# Altium schematic sheet measurement_rev4.SchDoc
size A2
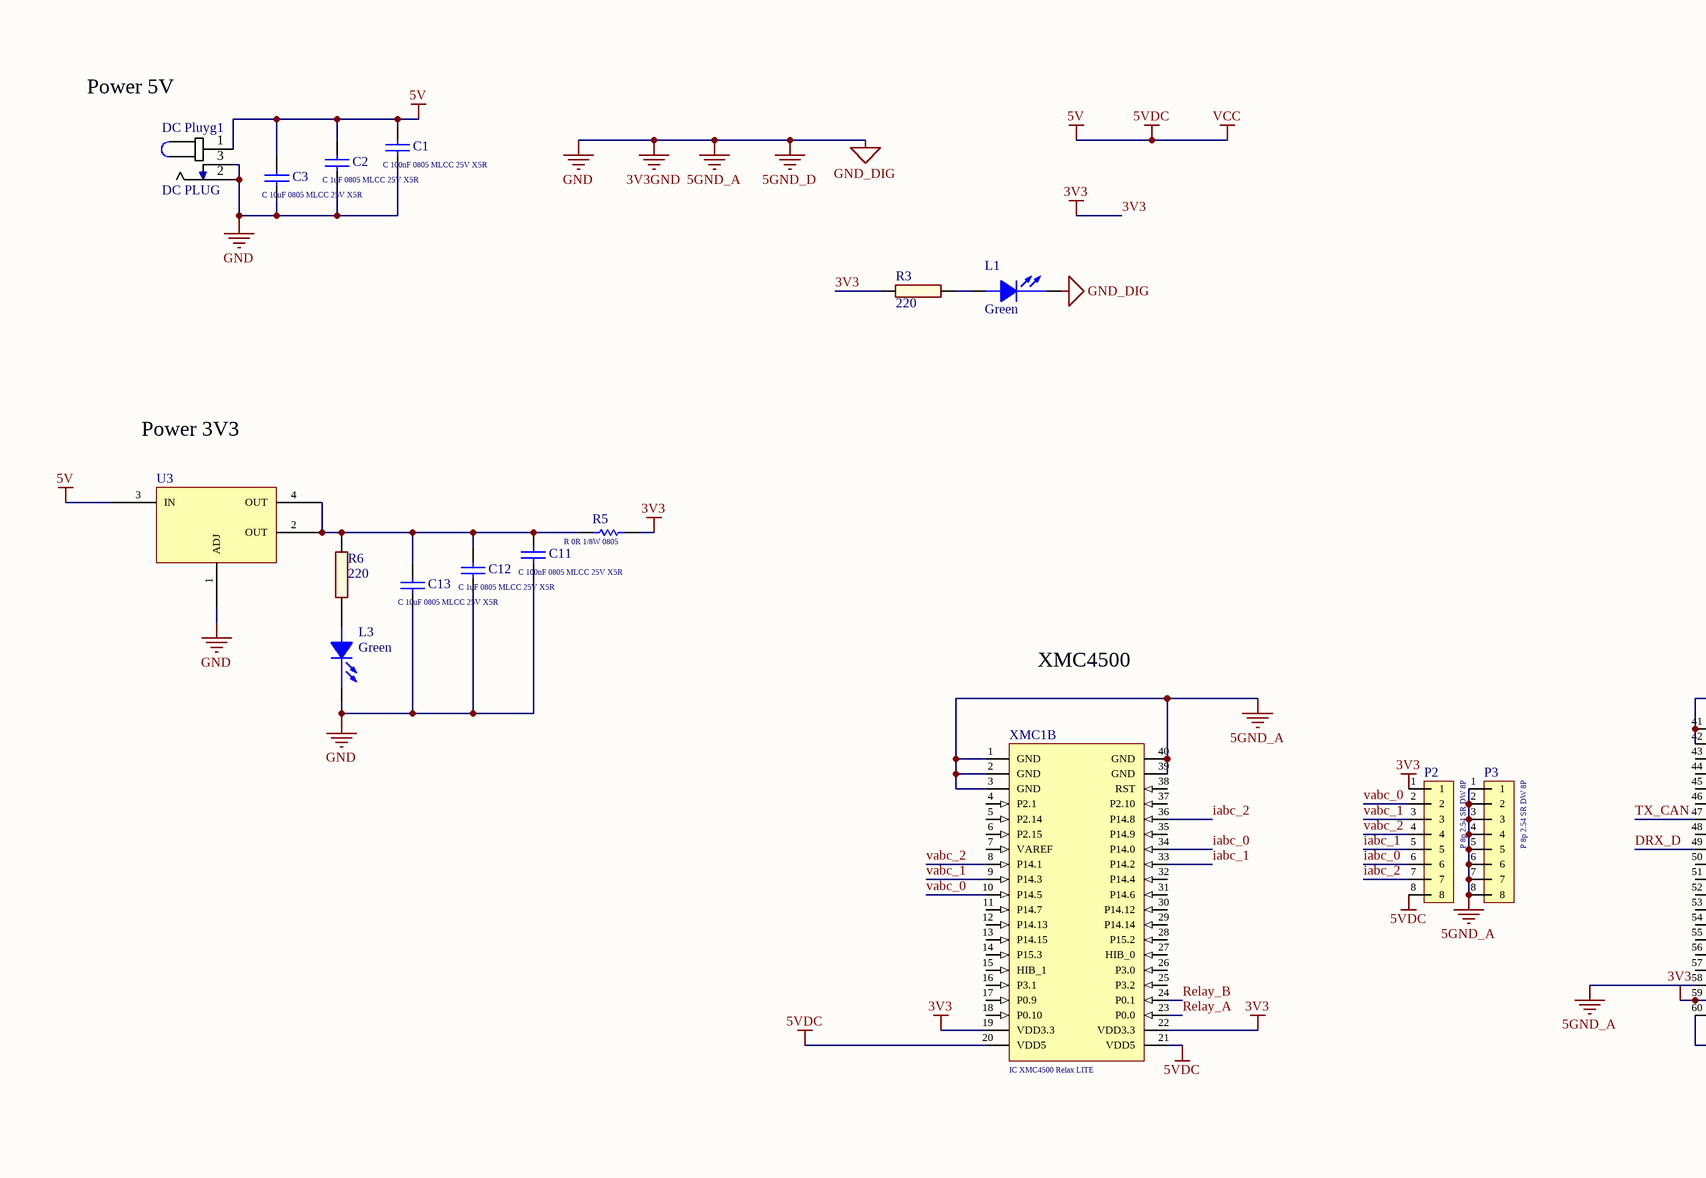
[diagram p0: measurement_rev4.SchDoc, top left]
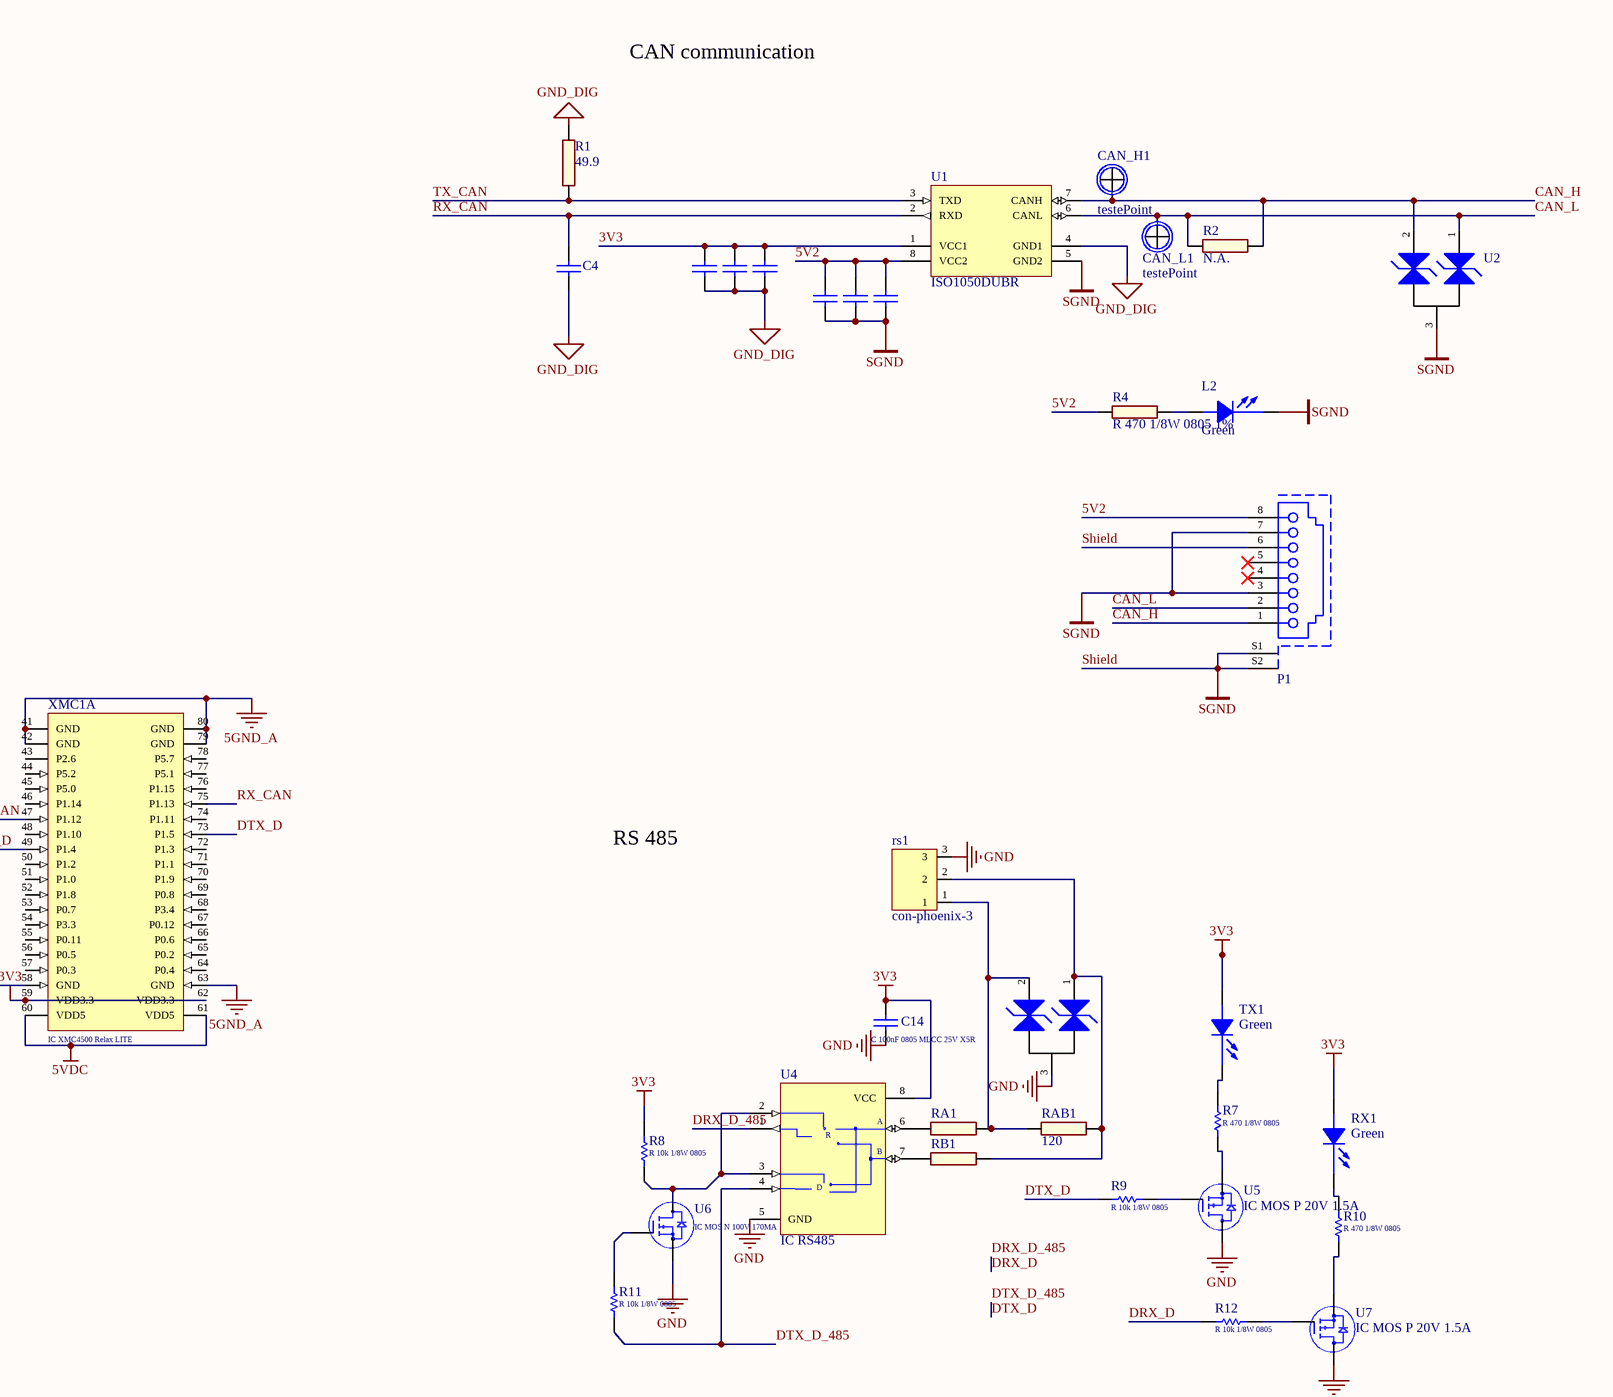
[diagram p1: measurement_rev4.SchDoc, top right]
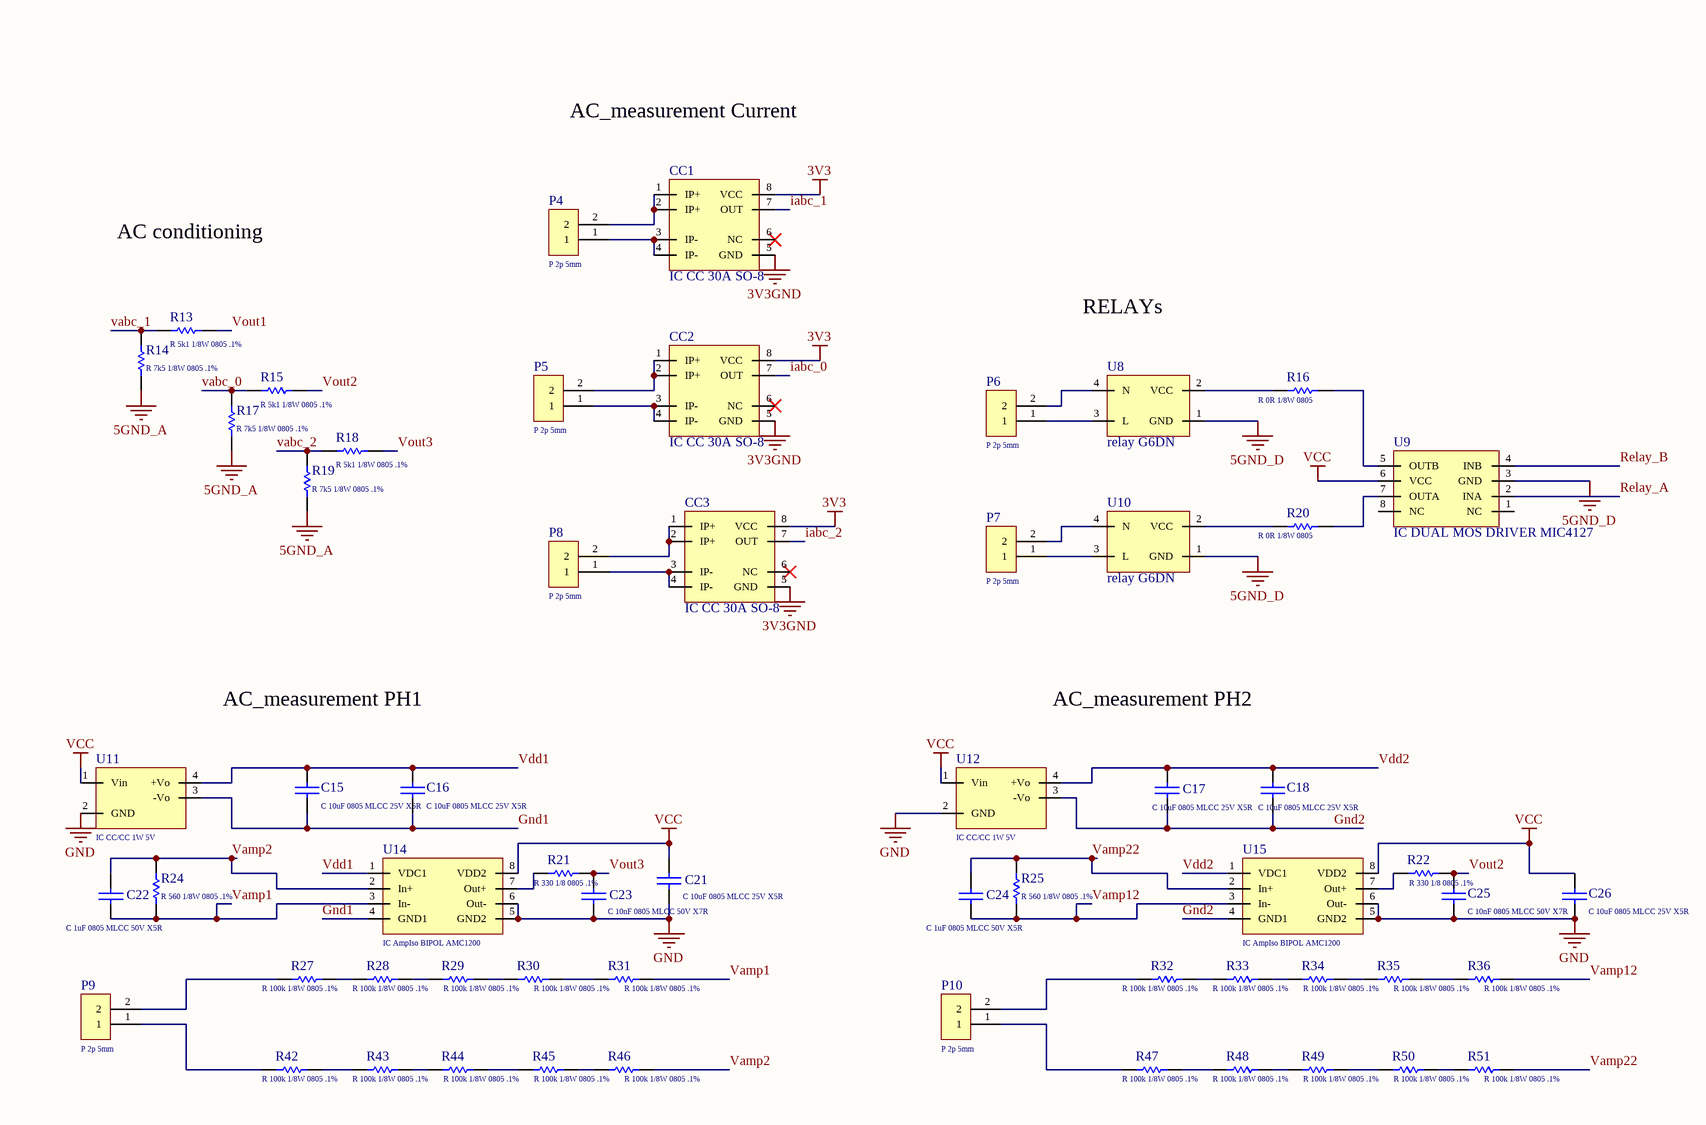
[diagram p2: measurement_rev4.SchDoc, bottom left]
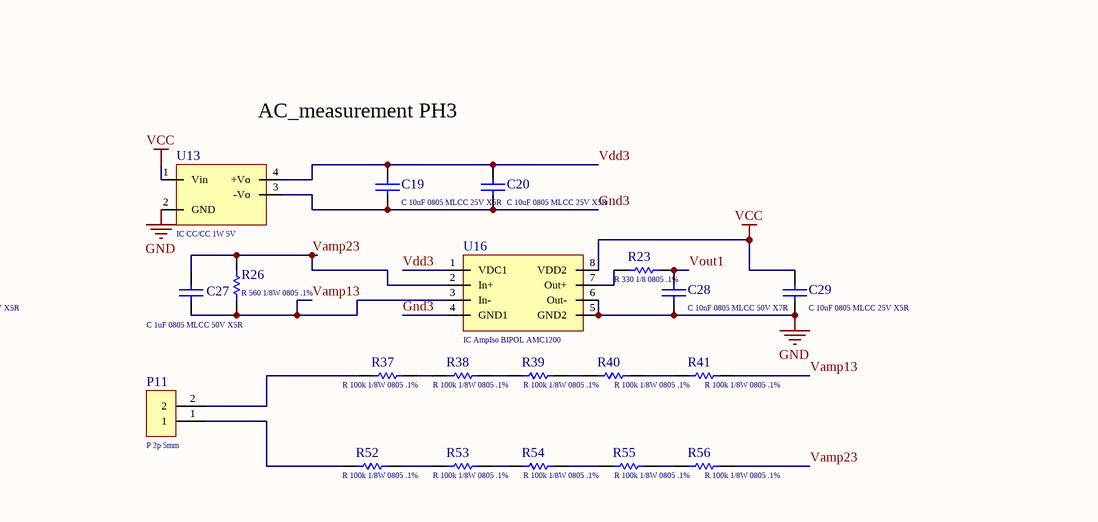
[diagram p3: measurement_rev4.SchDoc, bottom right]

## Parts
C1  C 100nF 0805 MLCC 25V X5R  [CAPC_0805]
C2  C 1uF 0805 MLCC 25V X5R  [CAPC_0805]
C3  C 10uF 0805 MLCC 25V X5R  [CAPC_0805]
C4  Capacitor  [CAPC_0805]  (value not drawn)
C5  Capacitor  [CAPC_0805]  (value not drawn)
C6  Capacitor  [CAPC_0805]  (value not drawn)
C7  Capacitor  [CAPC_0805]  (value not drawn)
C8  Capacitor  [CAPC_0805]  (value not drawn)
C9  Capacitor  [CAPC_0805]  (value not drawn)
C10  Capacitor  [CAPC_0805]  (value not drawn)
C11  C 100nF 0805 MLCC 25V X5R  [CAPC_0805]
C12  C 1uF 0805 MLCC 25V X5R  [CAPC_0805]
C13  C 10uF 0805 MLCC 25V X5R  [CAPC_0805]
C14  C 100nF 0805 MLCC 25V X5R  [CAPC_0805]
C15  C 10uF 0805 MLCC 25V X5R  [CAPC_0805]
C16  C 10uF 0805 MLCC 25V X5R  [CAPC_0805]
C17  C 10uF 0805 MLCC 25V X5R  [CAPC_0805]
C18  C 10uF 0805 MLCC 25V X5R  [CAPC_0805]
C19  C 10uF 0805 MLCC 25V X5R  [CAPC_0805]
C20  C 10uF 0805 MLCC 25V X5R  [CAPC_0805]
C21  C 10uF 0805 MLCC 25V X5R  [CAPC_0805]
C22  C 1uF 0805 MLCC 50V X5R  [CAPC_0805]
C23  C 10nF 0805 MLCC 50V X7R  [CAPC_0805]
C24  C 1uF 0805 MLCC 50V X5R  [CAPC_0805]
C25  C 10nF 0805 MLCC 50V X7R  [CAPC_0805]
C26  C 10uF 0805 MLCC 25V X5R  [CAPC_0805]
C27  C 1uF 0805 MLCC 50V X5R  [CAPC_0805]
C28  C 10nF 0805 MLCC 50V X7R  [CAPC_0805]
C29  C 10uF 0805 MLCC 25V X5R  [CAPC_0805]
CAN_H1  testePoint  [PAD 2.5MM - FURO 1.25MM]
CAN_L1  testePoint  [PAD 2.5MM - FURO 1.25MM]
CC1  IC CC 30A SO-8  [CC6303_SOP8]
CC2  IC CC 30A SO-8  [CC6303_SOP8]
CC3  IC CC 30A SO-8  [CC6303_SOP8]
DC_Pluyg1  DC PLUG  [DC Plug]
L1  Green  [CD2012-0805]
L2  Green  [CD2012-0805]
L3  Green  [CD2012-0805]
P1  61500814221  [61500814221]  (value not drawn)
P2  P 8p 2.54 SR DW 8P  [Header 8x1 8.5mm]
P3  P 8p 2.54 SR DW 8P  [Header 8x1 8.5mm]
P4  P 2p 5mm  [connector1x2_parafuso]
P5  P 2p 5mm  [connector1x2_parafuso]
P6  P 2p 5mm  [connector1x2_parafuso]
P7  P 2p 5mm  [connector1x2_parafuso]
P8  P 2p 5mm  [connector1x2_parafuso]
P9  P 2p 5mm  [connector1x2_parafuso]
P10  P 2p 5mm  [connector1x2_parafuso]
P11  P 2p 5mm  [connector1x2_parafuso]
R1  49.9  [RESC_0805]
R2  N.A.  [RESC_0805]
R3  220  [RESC_0805]
R4  R 470 1/8W 0805 1%  [RESC_0805]
R5  R 0R 1/8W 0805  [RESC_0805]
R6  220  [RESC_0805]
R7  R 470 1/8W 0805  [RESC_0805]
R8  R 10k 1/8W 0805  [RESC_0805]
R9  R 10k 1/8W 0805  [RESC_0805]
R10  R 470 1/8W 0805  [RESC_0805]
R11  R 10k 1/8W 0805  [RESC_0805]
R12  R 10k 1/8W 0805  [RESC_0805]
R13  R 5k1 1/8W 0805 .1%  [RESC_0805]
R14  R 7k5 1/8W 0805 .1%  [RESC_0805]
R15  R 5k1 1/8W 0805 .1%  [RESC_0805]
R16  R 0R 1/8W 0805  [RESC_0805]
R17  R 7k5 1/8W 0805 .1%  [RESC_0805]
R18  R 5k1 1/8W 0805 .1%  [RESC_0805]
R19  R 7k5 1/8W 0805 .1%  [RESC_0805]
R20  R 0R 1/8W 0805  [RESC_0805]
R21  R 330 1/8 0805 .1%  [RESC_0805]
R22  R 330 1/8 0805 .1%  [RESC_0805]
R23  R 330 1/8 0805 .1%  [RESC_0805]
R24  R 560 1/8W 0805 .1%  [RESC_0805]
R25  R 560 1/8W 0805 .1%  [RESC_0805]
R26  R 560 1/8W 0805 .1%  [RESC_0805]
R27  R 100k 1/8W 0805 .1%  [RESC_0805]
R28  R 100k 1/8W 0805 .1%  [RESC_0805]
R29  R 100k 1/8W 0805 .1%  [RESC_0805]
R30  R 100k 1/8W 0805 .1%  [RESC_0805]
R31  R 100k 1/8W 0805 .1%  [RESC_0805]
R32  R 100k 1/8W 0805 .1%  [RESC_0805]
R33  R 100k 1/8W 0805 .1%  [RESC_0805]
R34  R 100k 1/8W 0805 .1%  [RESC_0805]
R35  R 100k 1/8W 0805 .1%  [RESC_0805]
R36  R 100k 1/8W 0805 .1%  [RESC_0805]
R37  R 100k 1/8W 0805 .1%  [RESC_0805]
R38  R 100k 1/8W 0805 .1%  [RESC_0805]
R39  R 100k 1/8W 0805 .1%  [RESC_0805]
R40  R 100k 1/8W 0805 .1%  [RESC_0805]
R41  R 100k 1/8W 0805 .1%  [RESC_0805]
R42  R 100k 1/8W 0805 .1%  [RESC_0805]
R43  R 100k 1/8W 0805 .1%  [RESC_0805]
R44  R 100k 1/8W 0805 .1%  [RESC_0805]
R45  R 100k 1/8W 0805 .1%  [RESC_0805]
R46  R 100k 1/8W 0805 .1%  [RESC_0805]
R47  R 100k 1/8W 0805 .1%  [RESC_0805]
R48  R 100k 1/8W 0805 .1%  [RESC_0805]
R49  R 100k 1/8W 0805 .1%  [RESC_0805]
R50  R 100k 1/8W 0805 .1%  [RESC_0805]
R51  R 100k 1/8W 0805 .1%  [RESC_0805]
R52  R 100k 1/8W 0805 .1%  [RESC_0805]
R53  R 100k 1/8W 0805 .1%  [RESC_0805]
R54  R 100k 1/8W 0805 .1%  [RESC_0805]
R55  R 100k 1/8W 0805 .1%  [RESC_0805]
R56  R 100k 1/8W 0805 .1%  [RESC_0805]
RA1  10  [RESC_0805]  (value not drawn)
RAB1  120  [RESC_1206]
RB1  10  [RESC_0805]  (value not drawn)
rs1  con-phoenix-3  [molex 3P]
RX1  Green  [CD2012-0805]
TVS1  Diode_TVS_Array  [SOT23-3]  (value not drawn)
TX1  Green  [CD2012-0805]
U1  ISO1050DUBR  [DUB8_M]
U2  Diode_TVS_Array  [SOT23-3]  (value not drawn)
U3  IC DCDC 3V3 SOT223  [PG-SOT-223]  (value not drawn)
U4  IC RS485  [NSO8_M]
U5  IC MOS P 20V 1.5A  [SOT23-3]
U6  IC MOS N 100V 170MA  [SOT23-3]
U7  IC MOS P 20V 1.5A  [SOT23-3]
U8  relay G6DN  [Relay - G6DN]
U9  IC DUAL MOS DRIVER MIC4127  [SOIC-MIC4126]
U10  relay G6DN  [Relay - G6DN]
U11  IC CC/CC 1W 5V  [DC/DC_ISO]
U12  IC CC/CC 1W 5V  [DC/DC_ISO]
U13  IC CC/CC 1W 5V  [DC/DC_ISO]
U14  IC AmpIso BIPOL AMC1200  [SOIC8]
U15  IC AmpIso BIPOL AMC1200  [SOIC8]
U16  IC AmpIso BIPOL AMC1200  [SOIC8]
XMC1  IC XMC4500 Relax LITE  [XMC4500]  (parts A,B of 2)

## Nets
3V3: C5.2 C6.2 C7.2 C14.2 CC1.8(VCC) CC2.8(VCC) CC3.8(VCC) P2.1 R3.1 R5.2 R8.2 RX1.A(ANODE) TX1.A(ANODE) U1.1(VCC1) U4.8(VCC) XMC1.19(VDD3.3) XMC1.22(VDD3.3) XMC1.59(VDD3.3) XMC1.62(VDD3.3)
3V3GND: C1.1 C2.1 C3.1 C4.1 C5.1 C6.1 C7.1 C11.1 C12.1 C13.1 C14.1 C21.1 C23.1 C25.1 C26.1 C28.1 C29.1 CC1.5(GND) CC2.5(GND) CC3.5(GND) DC_Pluyg1.2 DC_Pluyg1.3 L1.C(CATHODE) L3.C(CATHODE) P3.1 P3.2 P3.3 P3.4 P3.5 P3.6 P3.7 P3.8 R1.2 R14.1 R17.1 R19.1 rs1.3 TVS1.3 U1.4(GND1) U3.1(ADJ) U4.5(GND) U5.3(D) U6.2(S) U7.3(D) U8.1(GND) U9.3(GND) U10.1(GND) U11.2(GND) U12.2(GND) U13.2(GND) U14.5(GND2) U14.6(Out-) U15.5(GND2) U15.6(Out-) U16.5(GND2) U16.6(Out-) XMC1.1(GND) XMC1.2(GND) XMC1.3(GND) XMC1.39(GND) XMC1.40(GND) XMC1.41(GND) XMC1.42(GND) XMC1.58(GND) XMC1.63(GND) XMC1.79(GND) XMC1.80(GND)  [also labelled 5GND_A, 5GND_D, GND, GND_DIG]
5V: C1.2 C2.2 C3.2 C21.2 C26.2 C29.2 DC_Pluyg1.1 P2.8 U3.3(IN) U9.6(VCC) U11.1(Vin) U12.1(Vin) U13.1(Vin) U14.8(VDD2) U15.8(VDD2) U16.8(VDD2) XMC1.20(VDD5) XMC1.21(VDD5) XMC1.60(VDD5) XMC1.61(VDD5)  [also labelled 5VDC, VCC]
Shield: C8.1 C9.1 C10.1 L2.C(CATHODE) P1.3 P1.6 P1.7 P1.S1(Shield) P1.S2(Shield) U1.5(GND2) U2.3  [also labelled SGND]
5V2: C8.2 C9.2 C10.2 P1.8 R4.1 U1.8(VCC2)
CAN_H: CAN_H1.1 P1.1 R2.1 U1.7(CANH) U2.2
CAN_L: CAN_L1.1 P1.2 R2.2 U1.6(CANL) U2.1
DRX_D: R12.2 U4.1(RO) XMC1.49(P1.4)  [also labelled DRX_D_485]
DTX_D: R9.2 R11.1 U4.4(DI) XMC1.73(P1.5)  [also labelled DTX_D_485]
Gnd1: C15.1 C16.1 U11.3(-Vo) U14.4(GND1)
Gnd2: C17.1 C18.1 U12.3(-Vo) U15.4(GND1)
Gnd3: C19.1 C20.1 U13.3(-Vo) U16.4(GND1)
iabc_0: CC2.7(OUT) P2.6 XMC1.34(P14.0)
iabc_1: CC1.7(OUT) P2.5 XMC1.33(P14.2)
iabc_2: CC3.7(OUT) P2.7 XMC1.36(P14.8)
Relay_A: U9.2(INA) XMC1.23(P0.0)
Relay_B: U9.4(INB) XMC1.24(P0.1)
RX_CAN: C4.2 U1.2(RXD) XMC1.75(P1.13)
TX_CAN: R1.1 U1.3(TXD) XMC1.47(P1.12)
vabc_0: P2.2 R15.1 R17.2 XMC1.10(P14.5)
vabc_1: P2.3 R13.1 R14.2 XMC1.9(P14.3)
vabc_2: P2.4 R18.1 R19.2 XMC1.8(P14.1)
Vamp1: C22.1 R24.1 R31.2 U14.3(In-)
Vamp2: C22.2 R24.2 R46.2 U14.2(In+)
Vamp12: C24.1 R25.1 R36.2 U15.3(In-)
Vamp13: C27.1 R26.1 R41.2 U16.3(In-)
Vamp22: C24.2 R25.2 R51.2 U15.2(In+)
Vamp23: C27.2 R26.2 R56.2 U16.2(In+)
Vdd1: C15.2 C16.2 U11.4(+Vo) U14.1(VDC1)
Vdd2: C17.2 C18.2 U12.4(+Vo) U15.1(VDC1)
Vdd3: C19.2 C20.2 U13.4(+Vo) U16.1(VDC1)
Vout1: C28.2 R13.2 R23.2
Vout2: C25.2 R15.2 R22.2
Vout3: C23.2 R18.2 R21.2
NetC11_2: C11.2 C12.2 C13.2 R5.1 R6.2 U3.2(OUT) U3.4(OUT)
NetCC1_1: CC1.1(IP+) CC1.2(IP+) P4.2
NetCC1_3: CC1.3(IP-) CC1.4(IP-) P4.1
NetCC2_1: CC2.1(IP+) CC2.2(IP+) P5.2
NetCC2_3: CC2.3(IP-) CC2.4(IP-) P5.1
NetCC3_1: CC3.1(IP+) CC3.2(IP+) P8.2
NetCC3_3: CC3.3(IP-) CC3.4(IP-) P8.1
NetL1_A: L1.A(ANODE) R3.2
NetL2_A: L2.A(ANODE) R4.2
NetL3_A: L3.A(ANODE) R6.1
NetP6_1: P6.1 U8.3(L)
NetP6_2: P6.2 U8.4(N)
NetP7_1: P7.1 U10.3(L)
NetP7_2: P7.2 U10.4(N)
NetP9_1: P9.1 R42.1
NetP9_2: P9.2 R27.1
NetP10_1: P10.1 R47.1
NetP10_2: P10.2 R32.1
NetP11_1: P11.1 R52.1
NetP11_2: P11.2 R37.1
NetR7_1: R7.1 TX1.C(CATHODE)
NetR7_2: R7.2 U5.2(S)
NetR8_1: R8.1 U4.2(~{RE}) U4.3(DE) U6.3(D)
NetR9_1: R9.1 U5.1(G)
NetR10_1: R10.1 RX1.C(CATHODE)
NetR10_2: R10.2 U7.2(S)
NetR11_2: R11.2 U6.1(G)
NetR12_1: R12.1 U7.1(G)
NetR16_1: R16.1 U8.2(VCC)
NetR16_2: R16.2 U9.5(OUTB)
NetR20_1: R20.1 U10.2(VCC)
NetR20_2: R20.2 U9.7(OUTA)
NetR21_1: R21.1 U14.7(Out+)
NetR22_1: R22.1 U15.7(Out+)
NetR23_1: R23.1 U16.7(Out+)
NetR27_2: R27.2 R28.1
NetR28_2: R28.2 R29.1
NetR29_2: R29.2 R30.1
NetR30_2: R30.2 R31.1
NetR32_2: R32.2 R33.1
NetR33_2: R33.2 R34.1
NetR34_2: R34.2 R35.1
NetR35_2: R35.2 R36.1
NetR37_2: R37.2 R38.1
NetR38_2: R38.2 R39.1
NetR39_2: R39.2 R40.1
NetR40_2: R40.2 R41.1
NetR42_2: R42.2 R43.1
NetR43_2: R43.2 R44.1
NetR44_2: R44.2 R45.1
NetR45_2: R45.2 R46.1
NetR47_2: R47.2 R48.1
NetR48_2: R48.2 R49.1
NetR49_2: R49.2 R50.1
NetR50_2: R50.2 R51.1
NetR52_2: R52.2 R53.1
NetR53_2: R53.2 R54.1
NetR54_2: R54.2 R55.1
NetR55_2: R55.2 R56.1
NetRA1_1: RA1.1 RAB1.1 rs1.1 TVS1.2
NetRA1_2: RA1.2 U4.6(A)
NetRAB1_2: RAB1.2 RB1.1 rs1.2 TVS1.1
NetRB1_2: RB1.2 U4.7(B)

Not connected (* = marked no-connect by the designer): CC1 6(NC)*; CC2 6(NC)*; CC3 6(NC)*; P1 4* 5*; U9 1(NC) 8(NC); XMC1 4(P2.1) 5(P2.14) 6(P2.15) 7(VAREF) 11(P14.7) 12(P14.13) 13(P14.15) 14(P15.3) 15(HIB_1) 16(P3.1) 17(P0.9) 18(P0.10) 25(P3.2) 26(P3.0) 27(HIB_0) 28(P15.2) 29(P14.14) 30(P14.12) 31(P14.6) 32(P14.4) 35(P14.9) 37(P2.10) 38(RST) 43(P2.6) 44(P5.2) 45(P5.0) 46(P1.14) 48(P1.10) 50(P1.2) 51(P1.0) 52(P1.8) 53(P0.7) 54(P3.3) 55(P0.11) 56(P0.5) 57(P0.3) 64(P0.4) 65(P0.2) 66(P0.6) 67(P0.12) 68(P3.4) 69(P0.8) 70(P1.9) 71(P1.1) 72(P1.3) 74(P1.11) 76(P1.15) 77(P5.1) 78(P5.7)

## Notes on the sheet
- (near DC_Pluyg1) Power 5V
- CAN communication
- Power 3V3
- XMC4500
- RS 485
- AC_measurement Current
- AC conditioning
- RELAYs
- AC_measurement PH1
- AC_measurement PH2
- AC_measurement PH3
- (in symbol MAX481CSA) R; D

## Library data of the parts
C1 C11 C14 = Capacitor SMD: MULTILAYER CERAMIC CAPACITORS MLCC - SMD/SMT 100NF 50V 0805 ROHS; LCSC PART #: C49678
C2 C12 = Capacitor SMD: MULTILAYER CERAMIC CAPACITORS MLCC - SMD/SMT 1UF 50V 0805 ROHS; LCSC PART #: C28323
C3 C13 C15-C21 C26 C29 = Capacitor SMD: Capacitores de cerâmica multicamada MLCC - SMD/SMT 10uF 25V X5R +/-10% 0805 Gen Purp; Mouser VPN: 963-TMK212BBJ106KG-T; Price: 0,162; LCSC PART #: C15850
C4 = Capacitor: Value: 15 pF; LCSC PART #: C1794
C5 = Capacitor: Value: 1u; LCSC PART #: C28323
C6 C9 = Capacitor: Value: 0.1 uF; LCSC PART #: C49678
C7 C10 = Capacitor: Value: 0.01 uF; LCSC PART #: C1710
C8 = Capacitor: Value: 1uF; LCSC PART #: C28323
C22 C24 C27 = Capacitor SMD: Capacitores de cerâmica multicamada MLCC - SMD/SMT 0805 50V 1uF 20% X5R; Mouser VPN: 963-UMK212BJ105MG-T; Price: 0,153; LCSC PART #: C28323
C23 C25 C28 = Capacitor SMD: Capacitores de cerâmica multicamada MLCC - SMD/SMT 10nF 50V X7R 10%; Mouser VPN: 603-CC805KRX7R9BB103; Price: 0,099; LCSC PART #: C1710
CC1-CC3 = Current_Sensor_cc6303: Sensores de Corrente de Montagem de Painel Hall Effect IC LF 30A 66 mV/A; Mouser VPN: 630-ACHS-7123-000E; Price: 3,47; LCSC PART #: C163283
L1-L3 RX1 TX1 = LED_GREEN: LED 2X1.2MM 570NM GN WTR CLR SMD; Manufacturer: Kingbright; MPN: APT2012CGCK; VPN: 754-1127-1-ND; Vendor: Digikey; Value: Green
  L1-L3: LCSC PART #: C84256
  RX1 TX1: LCSC Part #: C84256
P1 = 61500814221: Modular Jack Horizontal Shielded 8P8C Tab Down WR-MJ; Rated Current: 1.5 A; Working Voltage: 120 VAC; Withstanding Voltage: 1000 VAC; Port: 1x1; ComponentLink1Description: Manufacturer; ComponentLink1URL: http://www.we-online.de; ComponentLink2Description: Datasheet; ComponentLink2URL: http://katalog.we-online.com/em/datasheet/61500814221.pdf; Part Number: 61500814221; Published Date: September 2017; Publisher: Wurth Elektronik; Pin Number: 8P8C; Entrance: Horizontal
P2 P3 = jumper_8p: Distribuidores e Alojamento de Fios CGrid Hrd SRDW THo le 8ckt; Mouser VPN: 538-87937-0800; Price: 0,621
P4-P11 = gen_purpose_conn_1x2: Bloques de terminales de PCB de perfil estándar RS de 5,0 mm; RS VPN: 896-6696; Price: 0,24
R1-R3 R6 = R2: Thick film resistor, SMD 0402, 1/16W, 1%; Manufacturer: Generic
  R1: Value: 49.9; LCSC PART #: C17720
  R2: Value: N.A.
  R3 R6: Value: 220; LCSC PART #: C17557
R4 = R2: Resistores de Filme Espesso - SMD 1/8Watt 470ohms 1% Commercial Use; Manufacturer: Generic; Value: 470; LCSC Part #: C17710
R5 R16 R20 = Resistor: Resistores de Filme Fino - SMD 0 ohm; LCSC PART #: C17477
R7 R10 = Resistor: CHIP RESISTOR - SURFACE MOUNT 470OHMS ±1% 1/8W 0805 ROHS; LCSC PART #: C17710
R8 R9 R11 R12 = Resistor: CHIP RESISTOR - SURFACE MOUNT 10KOHMS ±1% 1/8W 0805 ROHS; LCSC PART #: C17414
R13 R15 R18 = Resistor: Resistores de Filme Fino - SMD 0805 5.1Kohm 1/8W .1% 25ppm; Mouser VPN: 667-ERA-6AEB512V; Price: 0,324; LCSC PART #: C27834
R14 R17 R19 = Resistor: Resistores de Filme Fino - SMD 7.5K OHM .1% 25ppm; Mouser VPN: 66-PCF08C7.5KB; Price: 0,135; LCSC PART #: C17807
R21-R23 = Resistor: Resistores de Filme Fino - SMD CPF 0805 330R 0.1% 25PPM 1K RL; Mouser VPN: 279-CPF0805B330RE1; Price: 0,126; LCSC PART #: C17630
R24-R26 = Resistor: Resistores de Filme Fino - SMD 1/8W 3.6K ohm .1% 25ppm; Mouser VPN: 667-ERJ-PB6B5600V; Price: 0,324; LCSC PART #: C28636
R27-R56 = Resistor: Resistores de Filme Fino - SMD 100 Kohm .1% 0805 25PPM; Mouser VPN: 284-APC0805B100KN; Price: 0,126; LCSC PART #: C17407
RA1 RB1 = R2: CHIP RESISTOR - SURFACE MOUNT 10OHMS ±1% 1/8W 0805 ROHS; Manufacturer: Generic; Value: 10; LCSC Part #: C17415
RAB1 = R2: CHIP RESISTOR - SURFACE MOUNT 120OHMS ±1% 1/4W 1206 ROHS; Manufacturer: Generic; Value: 120; LCSC Part #: C17909
TVS1 = Diode_TVS_Array: DIODES - ESD SOT-23 ROHS; Value: CDSOT23-SM712; LCSC Part #: C404012
U1 = ISO1050DUBR: Isolated CAN Transceiver, -55 to 105 degC, 8-pin SOP (DUB), Green (RoHS & no Sb/Br); LCSC PART #: C16428
U2 = Diode_TVS_Array: Value: SM24CANB-02HTG; LCSC PART #: C151237
U3 = Component_1: LINEAR VOLTAGE REGULATORS SOT-223 ROHS; Value: IFX1117ME3V3; LCSC Part #: C91389
U4 = MAX481CSA: RS-485 & RS-422 1/1 20MBPS 3V ~ 3.6V SOIC-8_150MIL ROHS; Value: SN65HVD75DR; Published: 16-Jan-2001; LatestRevisionDate: 13-Apr-2006; LatestRevisionNote: IPC-7351 Footprint Added.; DatasheetVersion: Feb-1996; PackageReference: NSO8; Publisher: Altium Limited; PackageDescription: 8-Pin Small Outline Integrated Circuit 1.27 mm Pitch; Code_JEDEC: MS-012-AA; Code_IPC: SOIC127P600-8; ComponentLink1Description: Manufacturer Link; ComponentLink1URL: http://www.maxim-ic.com/; ComponentLink2Description: Datasheet; ComponentLink2URL: http://pdfserv.maxim-ic.com/en/ds/MAX1487-MAX491.pdf; LCSC Part #: C57928
U5 U7 = MOSFET_P: MOSFET P TRENCH 20V 1A 2.3V @ 250UA 180 M? @ 1.5A,10V SOT-23(SOT-23-3) ROHS; Value: ntr1p02; LCSC Part #: C129192
U6 = MOSFET: MOSFET N TRENCH 100V 170MA 2V @ 1MA 6 ? @ 170MA,10V SOT-23(SOT-23-3) ROHS; Value: BSS123; LCSC Part #: C79015
U8 U10 = Relay - G6DN
U9 = MOS_DRIVER-MIC4126: Drivers de portas 1.5A Dual High Speed MOSFET Driver with Low Thermal Impedance; Equivalente: TC4427AEOA; Mouser VPN: 998-MIC4126YME; Price: 0,756; LCSC PART #: C20551
U11-U13 = DC/DC_ISO: Conversores CC/CC com isolação 1W 5Vin 5Vout 200mA SIP7; Mouser VPN: 919-RFB-0505S; Price: 1,4
U14-U16 = AMC1200: Amplificadores de isolamento 4kV peak Iso Amp; Mouser VPN: 595-AMC1200BDWVR; Price: 4,62; LCSC PART #: C79905
XMC1 = XMC4500: "  KIT_XMC45_RELAX_LITE_V1 -  Evaluation Board, XMC4500 MCU, Detachable On-Board Debugger, USB Powered "; RS VPN: 251-8418; Farnell VPN: 2443552; Price: 14,628